# EAGLE design controller (EAGLE 5.12)
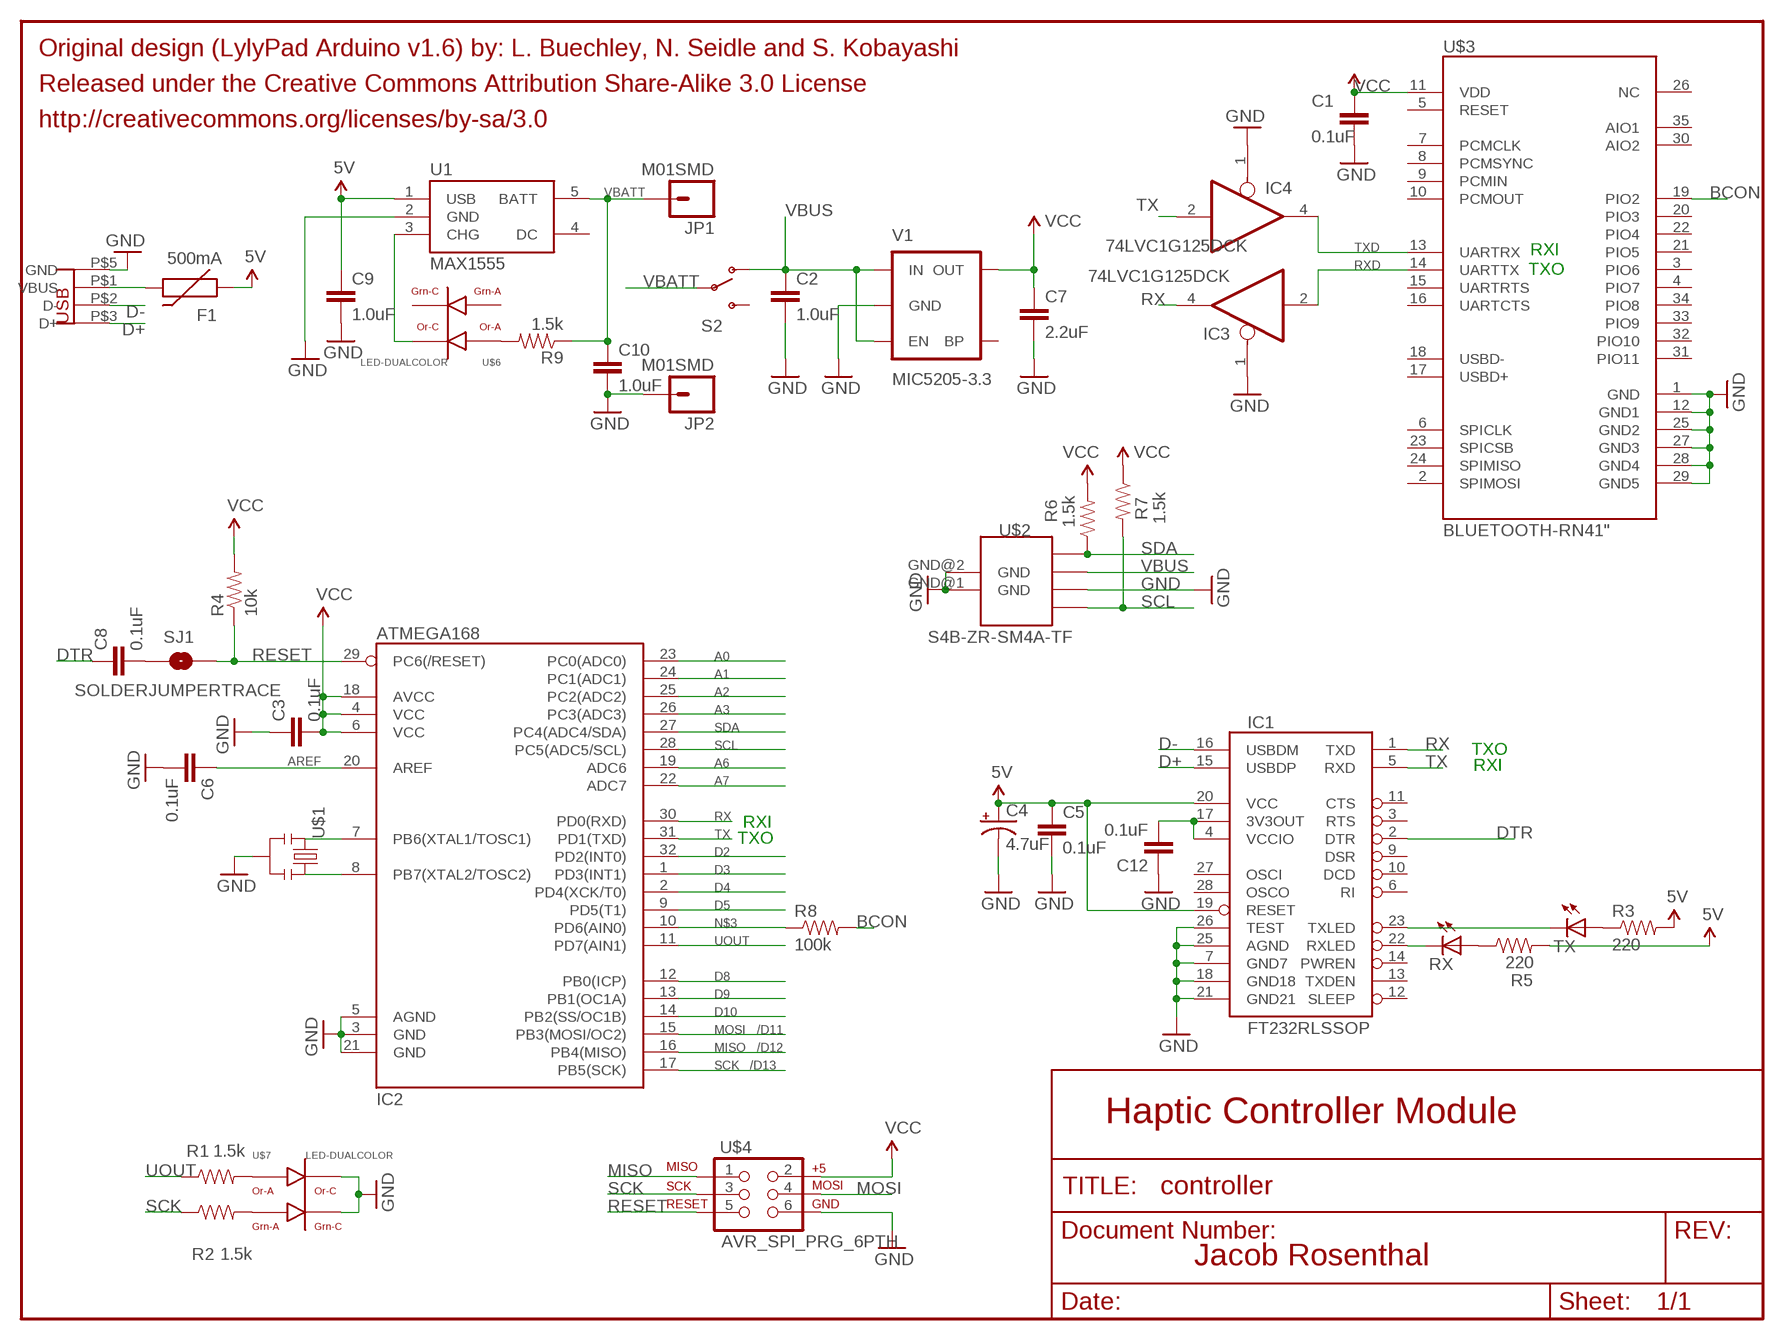
[diagram p0: schematic, sheet 1]

## Parts
C1  0.1uF  CAP0805  [0805]
C2  1.0uF  CAP0805  [0805]
C3  0.1uF  CAP0805  [0805]
C4  4.7uF  CAP_POL1206  [EIA3216]
C5  0.1uF  CAP0805  [0805]
C6  0.1uF  CAP0805  [0805]
C7  2.2uF  CAP0805  [0805]
C8  0.1uF  CAP0805  [0805]
C9  1.0uF  CAP0805  [0805]
C10  1.0uF  CAP0805  [0805]
C12  0.1uF  CAP0805  [0805]
F1  500mA  PTCSMD  [PTC-1206]
IC1  FT232RLSSOP  [SSOP28DB]
IC2  ATMEGA168  [TQFP32-08]
IC3  74LVC1G125DCK  [SC70-5]
IC4  74LVC1G125DCK  [SC70-5]
JP1  M01SMD  [LUXEON-PAD]
JP2  M01SMD  [LUXEON-PAD]
R1  1.5k  RESISTOR0805-RES  [0805]
R2  1.5k  RESISTOR0805-RES  [0805]
R3  220  RESISTOR0805-RES  [0805]
R4  10k  RESISTOR0805-RES  [0805]
R5  220  RESISTOR0805-RES  [0805]
R6  1.5k  RESISTOR0805-RES  [0805]
R7  1.5k  RESISTOR0805-RES  [0805]
R8  100k  RESISTOR0805-RES  [0805]
R9  1.5k  RESISTOR0805-RES  [0805]
RX  LEDCHIPLED_0805  [CHIPLED_0805]
S2  SWITCH-SPSTPTH  [SWITCH-SPDT]
SJ1  SOLDERJUMPERTRACE  [SJ_2S-TRACE]
TX  LEDCHIPLED_0805  [CHIPLED_0805]
U1  MAX1555  [SOT23-5]
U$1  CSTCE8M00G55Z  RESONATORSMD  [RESONATOR-SMD]
U$2  S4B-ZR-SM4A-TF  [S4B-ZR-SM4A-TF]
U$3  BLUETOOTH-RN41"  [RN41]
U$4  AVR_SPI_PRG_6PTH  [2X3]
U$6  LED-DUALCOLOR  [PLCC-4]
U$7  LED-DUALCOLOR  [PLCC-4]
V1  MIC5205-3.3  V_REG_LDOSMD  [SOT23-5]
X1  USBMICROB  [USB-MICROB]

## Nets
5V: C4.A(+) C5.1 C9.1 F1.1 IC1.19(RESET) IC1.20(VCC) R3.2 R5.2 U1.1(USB)
A0: IC2.23(PC0(ADC0))
A1: IC2.24(PC1(ADC1))
A2: IC2.25(PC2(ADC2))
A3: IC2.26(PC3(ADC3))
A6: IC2.19(ADC6)
A7: IC2.22(ADC7)
AREF: C6.1 IC2.20(AREF)
BCON: R8.2 U$3.19(PIO2)
D2: IC2.32(PD2(INT0))
D3: IC2.1(PD3(INT1))
D4: IC2.2(PD4(XCK/T0))
D5: IC2.9(PD5(T1))
D8: IC2.12(PB0(ICP))
D9: IC2.13(PB1(OC1A))
D10: IC2.14(PB2(SS/OC1B))
D+: IC1.15(USBDP) X1.P$3(D+)
D-: IC1.16(USBDM) X1.P$2(D-)
DTR: C8.1 IC1.2(DTR)
GND: C1.2 C2.2 C3.1 C4.C(-) C5.2 C6.2 C7.2 C9.2 C10.2 C12.1 IC1.7(GND7) IC1.18(GND18) IC1.21(GND21) IC1.25(AGND) IC1.26(TEST) IC2.3(GND) IC2.5(AGND) IC2.21(GND) IC3.1(OE) IC4.1(OE) JP2.P$1 U1.2(GND) U$1.2 U$2.GND@1(GND) U$2.GND@2(GND) U$2.P$2 U$3.1(GND) U$3.12(GND1) U$3.25(GND2) U$3.27(GND3) U$3.28(GND4) U$3.29(GND5) U$4.6 U$7.P$1 U$7.P$3 V1.2(GND) X1.P$5(GND)
MISO: IC2.16(PB4(MISO)) U$4.1
MOSI: IC2.15(PB3(MOSI/OC2)) U$4.4
N$1: IC1.23(TXLED) TX.C
N$2: U1.3(CHG) U$6.P$1
N$3: IC2.10(PD6(AIN0)) R8.1
N$4: F1.2 X1.P$1(VBUS)
N$5: C12.2 IC1.4(VCCIO) IC1.17(3V3OUT)
N$6: C8.2 SJ1.1
N$7: IC1.22(RXLED) RX.C
N$8: R9.2 U$6.P$2
N$9: R3.1 TX.A
N$10: IC2.7(PB6(XTAL1/TOSC1)) U$1.3
N$12: IC2.8(PB7(XTAL2/TOSC2)) U$1.1
N$13: R5.1 RX.A
N$14: R1.2 U$7.P$2
N$15: R2.2 U$7.P$4
RESET: IC2.29(PC6(/RESET)) R4.1 SJ1.2 U$4.5
RX: IC1.1(TXD) IC2.30(PD0(RXD)) IC3.4(O)
RXD: IC3.2(I) U$3.14(UARTTX)
SCK: IC2.17(PB5(SCK)) R2.1 U$4.3
SCL: IC2.28(PC5(ADC5/SCL)) R7.2 U$2.P$1
SDA: IC2.27(PC4(ADC4/SDA)) R6.1 U$2.P$4
TX: IC1.5(RXD) IC2.31(PD1(TXD)) IC4.2(I)
TXD: IC4.4(O) U$3.13(UARTRX)
UOUT: IC2.11(PD7(AIN1)) R1.1
VBATT [VCC]: C10.1 JP1.P$1 R9.1 S2.2(P) U1.5(BATT)
VBUS [VCC]: C2.1 S2.1(O) U$2.P$3 V1.1(IN) V1.3(EN)
VCC: C1.1 C3.2 C7.1 IC2.4(VCC) IC2.6(VCC) IC2.18(AVCC) R4.2 R6.2 R7.1 U$3.11(VDD) U$4.2 V1.5(OUT)
Unconnected: IC1.3(RTS) IC1.6(RI) IC1.9(DSR) IC1.10(DCD) IC1.11(CTS) IC1.12(SLEEP) IC1.13(TXDEN) IC1.14(PWREN) IC1.27(OSCI) IC1.28(OSCO) S2.3(S) U1.4(DC) U$3.2(SPIMOSI) U$3.3(PIO6) U$3.4(PIO7) U$3.5(RESET) U$3.6(SPICLK) U$3.7(PCMCLK) U$3.8(PCMSYNC) U$3.9(PCMIN) U$3.10(PCMOUT) U$3.15(UARTRTS) U$3.16(UARTCTS) U$3.17(USBD+) U$3.18(USBD-) U$3.20(PIO3) U$3.21(PIO5) U$3.22(PIO4) U$3.23(SPICSB) U$3.24(SPIMISO) U$3.26(NC) U$3.30(AIO2) U$3.31(PIO11) U$3.32(PIO10) U$3.33(PIO9) U$3.34(PIO8) U$3.35(AIO1) U$6.P$3 U$6.P$4 V1.4(BP)

## Notes on the sheet
- Original design (LylyPad Arduino v1.6) by: L. Buechley, N. Seidle and S. Kobayashi
- Released under the Creative Commons Attribution Share-Alike 3.0 License
- http://creativecommons.org/licenses/by-sa/3.0
- RXI
- TXO
- TXO
- RXI
- RXI
- TXO
- /D11
- /D12
- /D13
- Haptic Controller Module
- Jacob Rosenthal

## Power pins joined to a net without a drawn wire
GND: IC3.3(GND) IC4.3(GND)
VCC: IC3.5(VCC) IC4.5(VCC)

## Library data of the parts
C1-C3 C5-C10 C12 = SparkFun:CAP: Capacitor Standard 0603 ceramic capacitor, and 0.1" leaded capacitor.
C4 = haptic-controller:CAP_POL: Capacitor Polarized These are standard SMD and PTH capacitors. Normally 10uF, 47uF, and 100uF in electrolytic and tantalum varieties. Always verify the external diameter of the through hole cap, it varies with capacity, voltage, and manufacturer. The EIA devices should be standard. Originally From the Sparkfun Eagle Library @ www.opencircuits.com Dated Nov 3rd 2009 CC v3.0 Share-Alike
F1 = haptic-controller:PTC: Resettable Fuse PTC Resettable Fuse. Spark Fun Electronics SKU : COM-08357 Originally From the Sparkfun Eagle Library @ www.opencircuits.com Dated Nov 3rd 2009 CC v3.0 Share-Alike
IC1 = haptic-controller:FT232RL: USB UART FT232RL 4th Generation USB UART (USB <-> Serial) Controller. Spark Fun Electronics SKU : COM-00650 Originally From the Sparkfun Eagle Library @ www.opencircuits.com Dated Nov 3rd 2009 CC v3.0 Share-Alike
IC2 = haptic-controller:ATMEGA168: ATMEGA 168 Atmel AVR Originally From the Sparkfun Eagle Library @ www.opencircuits.com Dated Nov 3rd 2009 CC v3.0 Share-Alike
IC3 IC4 = 74xx-little-us:74*1G125: Single Bus Buffer Gate with 3-State Output
JP1 JP2 = haptic-controller:M01: Header 1 Standard 1-pin 0.1" header. Use with straight break away headers (SKU : PRT-00116), right angle break away headers (PRT-00553), swiss pins (PRT-00743), machine pins (PRT-00117), and female headers (PRT-00115). Originally From the Sparkfun Eagle Library @ www.opencircuits.com Dated Nov 3rd 2009 CC v3.0 Share-Alike
R1-R9 = SparkFun:RESISTOR: Resistor Basic schematic elements and footprints for 0603, 1206, and PTH resistors.
RX TX = led:LED: LED OSRAM: - CHIPLED LG R971, LG N971, LY N971, LG Q971, LY Q971, LO R971, LY R971 LH N974, LH R974 LS Q976, LO Q976, LY Q976 LO Q996 - Hyper CHIPLED LW Q18S LB Q993, LB Q99A, LB R99A - SideLED LS A670, LO A670, LY A670, LG A670, LP A670 LB A673, LV A673, LT A673, LW A673 LH A674 LY A675 LS A676, LA A676, LO A676, LY A676, LW A676 LS A679, LY A679, LG A679 - Hyper Micro SIDELED® LS Y876, LA Y876, LO Y876, LY Y876 LT Y87S - SmartLED LW L88C, LW L88S LB L89C, LB L89S, LG L890 LS L89K, LO L89K, LY L89K LS L896, LA L896, LO L896, LY L896 - TOPLED LS T670, LO T670, LY T670, LG T670, LP T670 LSG T670, LSP T670, LSY T670, LOP T670, LYG T670 LG T671, LOG T671, LSG T671 LB T673, LV T673, LT T673, LW T673 LH T674 LS T676, LA T676, LO T676, LY T676, LB T676, LH T676, LSB T676, LW T676 LB T67C, LV T67C, LT T67C, LS T67K, LO T67K, LY T67K, LW E67C LS E67B, LA E67B, LO E67B, LY E67B, LB E67C, LV E67C, LT E67C LW T67C LS T679, LY T679, LG T679 LS T770, LO T770, LY T770, LG T770, LP T770 LB T773, LV T773, LT T773, LW T773 LH T774 LS E675, LA E675, LY E675, LS T675 LS T776, LA T776, LO T776, LY T776, LB T776 LHGB T686 LT T68C, LB T68C - Hyper Mini TOPLED® LB M676 - Mini TOPLED Santana® LG M470 LS M47K, LO M47K, LY M47K Source: http://www.osram.convergy.de LUXEON: - LUMILED® LXK2-PW12-R00, LXK2-PW12-S00, LXK2-PW14-U00, LXK2-PW14-V00 LXK2-PM12-R00, LXK2-PM12-S00, LXK2-PM14-U00 LXK2-PE12-Q00, LXK2-PE12-R00, LXK2-PE12-S00, LXK2-PE14-T00, LXK2-PE14-U00 LXK2-PB12-K00, LXK2-PB12-L00, LXK2-PB12-M00, LXK2-PB14-N00, LXK2-PB14-P00, LXK2-PB14-Q00 LXK2-PR12-L00, LXK2-PR12-M00, LXK2-PR14-Q00, LXK2-PR14-R00 LXK2-PD12-Q00, LXK2-PD12-R00, LXK2-PD12-S00 LXK2-PH12-R00, LXK2-PH12-S00 LXK2-PL12-P00, LXK2-PL12-Q00, LXK2-PL12-R00 Source: www.luxeon.com KINGBRIGHT: KA-3528ASYC Source: www.kingbright.com
S2 = SparkFun:SWITCH-SPST: SPST Switch Simple slide switch. Spark Fun Electronics SKU : COM-00102
SJ1 = SparkFun:SOLDERJUMPER: Solder Jumper Standard SMD solder jumper. Used to automate production. Two varients : Normally Open and Normally Closed are the same, but have different paste layers. NC will have a large amount of paste and should jumper during reflow.
U1 = haptic-controller:MAX1555: MAX1555 Lithium Charger IC SOT-23 Lithium Polymer charging IC. Schematic element and footprint proven. Spark Fun Electronics SKU : COM-00674 Originally From the Sparkfun Eagle Library @ www.opencircuits.com Dated Nov 3rd 2009 CC v3.0 Share-Alike
U$1 = haptic-controller:RESONATOR: Resonator Small SMD resonator. This is the itty bitty 10/20MHz resonators with built in caps. CSTCE10M0G55 and CSTCE20M0V53. Footprint has been reviewed closely but hasn't been tested yet. Originally From the Sparkfun Eagle Library @ www.opencircuits.com Dated Nov 3rd 2009 CC v3.0 Share-Alike
U$2 = jjr:S4B-ZR-SM4A-TF: B4B-ZR-SM4-TF JST ZH 4pin side entry solder tab
U$3 = haptic-controller:BLUETOOTH-RN41: Roving Networks RN-41 Bluetooth Originally From the Sparkfun Eagle Library @ www.opencircuits.com Dated Nov 3rd 2009 CC v3.0 Share-Alike Altered to include restrict poly under chip antenna, ignore 3 restrict errors --jjrosent @ 1/11/2010
U$4 = haptic-controller:AVR_SPI_PRG_6: AVR ISP 6 Pin This is the reduced ISP connector for AVR programming. Common on Arduino. This footprint will take up less PCB space and can be used with a 10-pin to 6-pin adapter such as SKU: BOB-08508 Originally From the Sparkfun Eagle Library @ www.opencircuits.com Dated Nov 3rd 2009 CC v3.0 Share-Alike
U$6 U$7 = haptic-controller:LED-DUALCOLOR: Dual Color LED PLCC-4 Package. Based on OSRAM Opto Semiconductors Inc Part # LOG T77K-JL-1-0+GJ-1-0-2-R18-Z Designed for the CUbiC lab at Arizona State University by Jacob Rosenthal (jjrosent) 1/11/2010
V1 = haptic-controller:V_REG_LDO: Voltage Regulator LDO Standard 150mA LDO voltage regulator in SOT-23 layout. Micrel part MIC5205. BP (by-pass) pin is used to lower output noise with 470pF cap. Originally From the Sparkfun Eagle Library @ www.opencircuits.com Dated Nov 3rd 2009 CC v3.0 Share-Alike
X1 = haptic-controller:USBMICROB: Usb micro-b Designed for the CUbiC lab at Arizona State University by Jacob Rosenthal (jjrosent) 1/11/2010

## Net classes
0 Default: width 0.203 mm
1 VCC: width 0.701 mm
2 LEDPower: width 0.203 mm
3 ButtonSignal: width 0.203 mm
4 Bus: width 0.508 mm

## Board
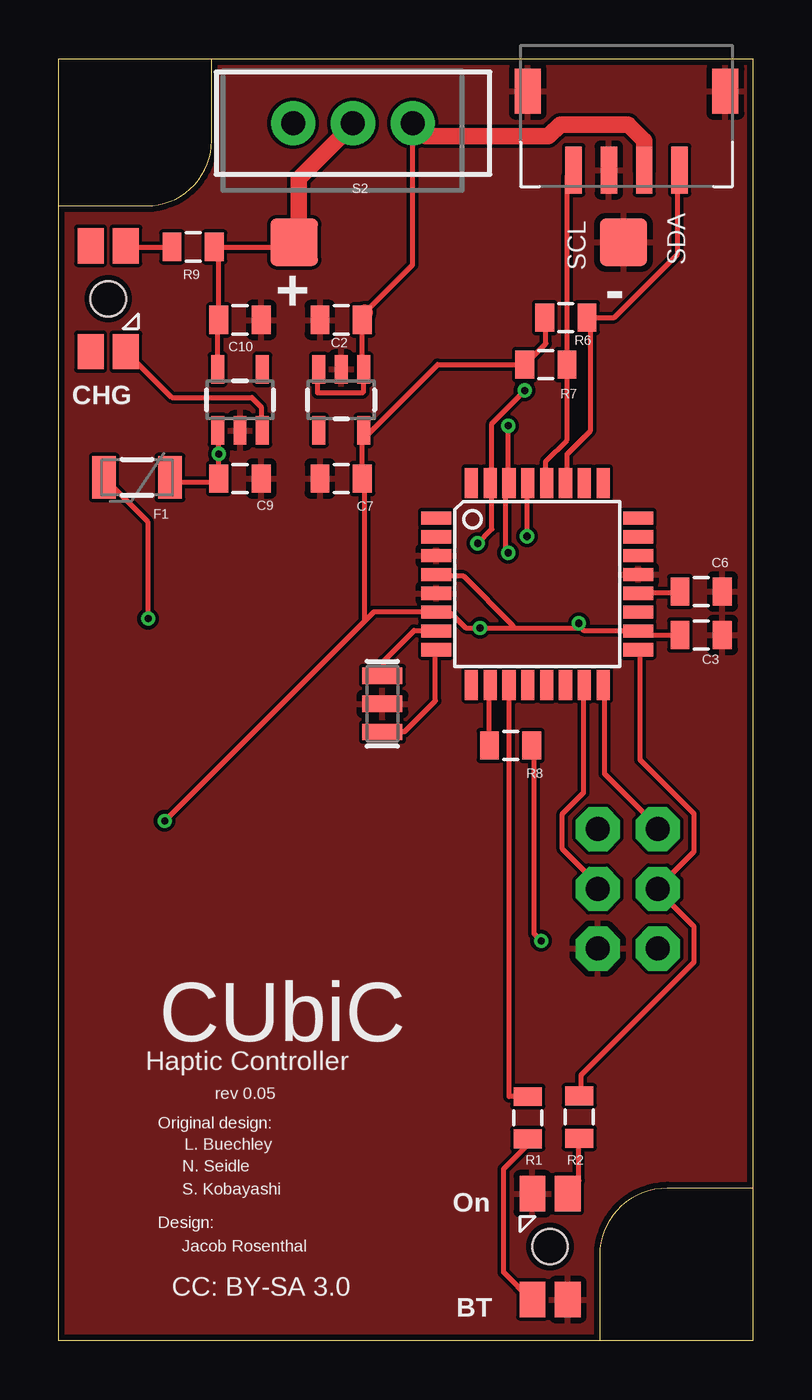
[diagram p1: board, top side]
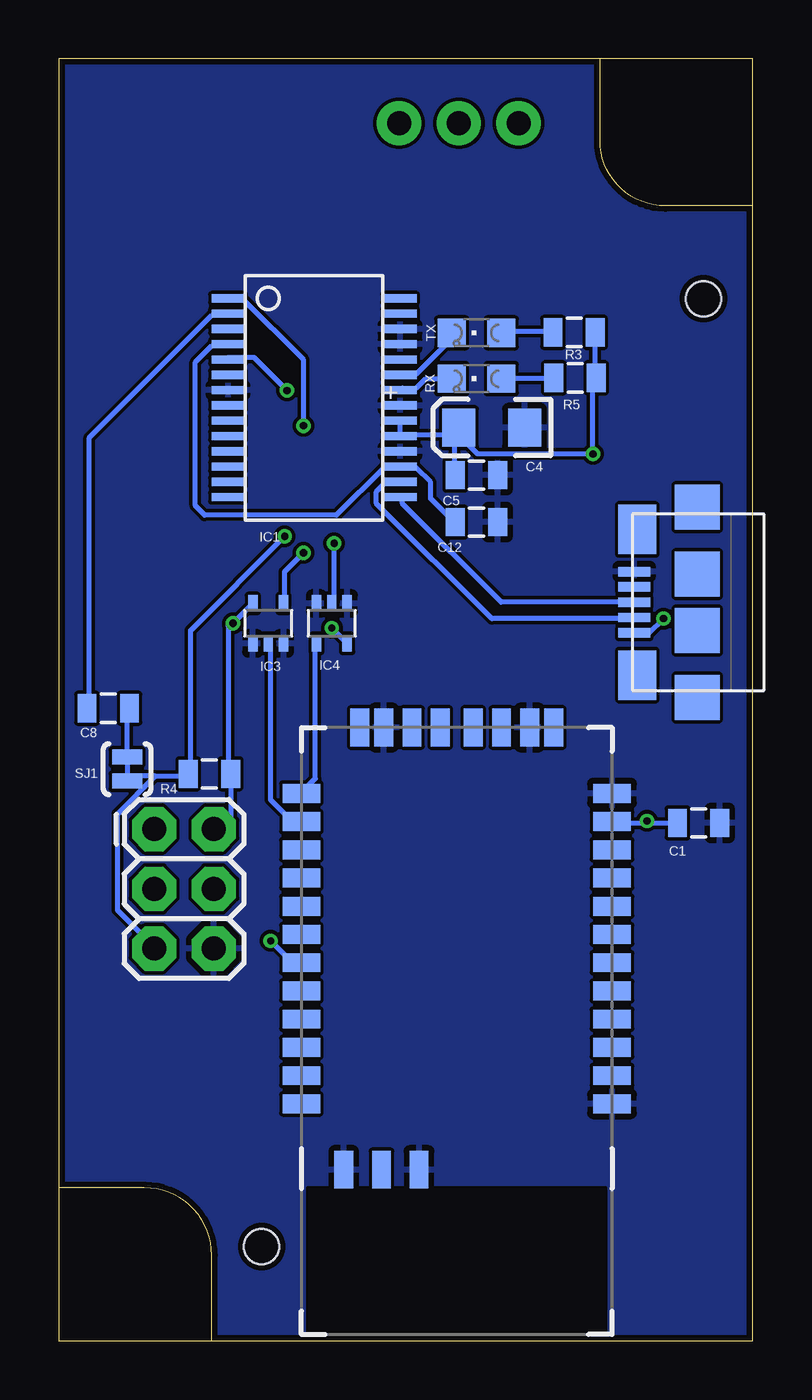
[diagram p2: board, bottom side, seen from below]

Size 29.5 x 54.5 mm. Coordinates in mm from the lower left corner, seen from the top.
Outline: 23,0 29.5,0 29.5,6.5
Outline: 23,0 0,0 0,48.25
Outline: 6.5,54.5 0,54.5 0,48.25
Outline: 6.5,54.5 29.5,54.5 29.5,6.5
Outline: 0,48.25 3.73,48.25 arc90 6.5,51.02 6.5,54.5
Outline: 23,0 23,3.64 arc-90 25.86,6.5 29.5,6.5
Copper layers (1*16): Top 0.035mm / dielectric 1.5mm / Bottom 0.035mm
Design rules "Fusion_eagle_rule_v1.1": minimum track width 6mil, minimum drill 12mil, track to track 6mil, track to pad 6mil, pad to pad 6mil, via to via 6mil, smd to smd 0mil, copper to edge 10mil, drill to drill 10mil, minimum pad ring 10mil, minimum via ring 6mil, stop-mask expansion 2mil, vias tented up to drill 100mil, thermal gap 10mil
bKeepout: area 25.1,7.3 to 27.6,9.8; area 2,11 to 4.5,13.5

### Footprints (pad centres in the part's own frame; a part is rotated, then mirrored left to right if it is on the bottom)
0805 = smd 0.8 x 1.2: 1 -0.9,0; 2 0.9,0
EIA3216 = smd 1.4 x 1.6: A 1.4,0; C -1.4,0
PTC-1206 = smd 1 x 1.8: 1 -1.4,0; 2 1.4,0
SSOP28DB = smd 0.348 x 1.397: 1 -4.225,-3.656; 2 -3.575,-3.656; 3 -2.925,-3.656; 4 -2.275,-3.656; 5 -1.625,-3.656; 6 -0.975,-3.656; 7 -0.325,-3.656; 8 0.325,-3.656; 9 0.975,-3.656; 10 1.625,-3.656; 11 2.275,-3.656; 12 2.925,-3.656; 13 3.575,-3.656; 14 4.225,-3.656; 15 4.225,3.656; 16 3.575,3.656; 17 2.925,3.656; 18 2.275,3.656; 19 1.625,3.656; 20 0.975,3.656; 21 0.325,3.656; 22 -0.325,3.656; 23 -0.975,3.656; 24 -1.625,3.656; 25 -2.275,3.656; 26 -2.925,3.656; 27 -3.575,3.656; 28 -4.225,3.656
TQFP32-08 = smd 1.27 x 0.559: 1 -4.293,2.8; 2 -4.293,2; 3 -4.293,1.2; 4 -4.293,0.4; 5 -4.293,-0.4; 6 -4.293,-1.2; 7 -4.293,-2; 8 -4.293,-2.8; 17 4.293,-2.8; 18 4.293,-2; 19 4.293,-1.2; 20 4.293,-0.4; 21 4.293,0.4; 22 4.293,1.2; 23 4.293,2; 24 4.293,2.8 | smd 0.559 x 1.27: 9 -2.8,-4.293; 10 -2,-4.293; 11 -1.2,-4.293; 12 -0.4,-4.293; 13 0.4,-4.293; 14 1.2,-4.293; 15 2,-4.293; 16 2.8,-4.293; 25 2.8,4.293; 26 2,4.293; 27 1.2,4.293; 28 0.4,4.293; 29 -0.4,4.293; 30 -1.2,4.293; 31 -2,4.293; 32 -2.8,4.293
SC70-5 = smd 0.4 x 0.7: 1 -0.65,-0.85; 2 0,-0.85; 3 0.65,-0.85; 4 0.65,0.85; 5 -0.65,0.85
LUXEON-PAD = smd 2 x 2: P$1 0,0
CHIPLED_0805 = smd 1.2 x 1.2: A 0,-1.05; C 0,1.05
SWITCH-SPDT = drill 1.016 pad 1.88 round: 1 0,2.54; 2 0,0; 3 0,-2.54
SJ_2S-TRACE = smd 0.635 x 1.27: 1 -0.508,0; 2 0.508,0
SOT23-5 = smd 0.55 x 1.2: 1 -0.95,-1.3; 2 0,-1.3; 3 0.95,-1.3; 4 0.95,1.3; 5 -0.95,1.3
RESONATOR-SMD = smd 0.7 x 1.7: 1 -1.2,0; 2 0,0; 3 1.2,0
S4B-ZR-SM4A-TF = smd 1.1 x 1.9: GND@1 -4.2,1.05; GND@2 4.2,1.05 | smd 0.7 x 2: P$1 -2.25,-2.3; P$2 -0.75,-2.3; P$3 0.75,-2.3; P$4 2.25,-2.3
RN41 = smd 0.8 x 1.6: 1 -6.6,-6.6; 2 -5.4,-6.6; 3 -4.2,-6.6; 4 -3,-6.6; 5 -1.8,-6.6; 6 -0.6,-6.6; 7 0.6,-6.6; 8 1.8,-6.6; 9 3,-6.6; 10 4.2,-6.6; 11 5.4,-6.6; 12 6.6,-6.6; 13 6.6,6.6; 14 5.4,6.6; 15 4.2,6.6; 16 3,6.6; 17 1.8,6.6; 18 0.6,6.6; 19 -0.6,6.6; 20 -1.8,6.6; 21 -3,6.6; 22 -4.2,6.6; 23 -5.4,6.6; 24 -6.6,6.6 | smd 1.6 x 0.8: 25 -9.4,4.8; 26 -9.4,3.2; 27 -9.4,1.6; 28 9.4,3.1; 29 9.4,-3.1; 30 9.4,-4.122; 31 9.4,-1.9; 32 9.4,-0.7; 33 9.4,0.7; 34 9.4,1.9; 35 9.4,4.122
2X3 = drill 1.016 pad 1.88 octagon: 1 0,0; 2 0,2.54; 3 2.54,0; 4 2.54,2.54; 5 5.08,0; 6 5.08,2.54
PLCC-4 = smd 1.5 x 1.1: P$1 -2.25,-0.75; P$2 2.25,-0.75; P$3 2.25,0.75; P$4 -2.25,0.75 | hole 1.5: 0,0
USB-MICROB = smd 0.4 x 1.35: P$1 -1.3,2.675; P$2 -0.65,2.675; P$3 0,2.675; P$4 0.65,2.675; P$5 1.3,2.675 | smd 2.1 x 1.6: P$6 -3.1,2.55; P$7 3.1,2.55 | smd 1.9 x 1.9: P$8 -4.05,0; P$9 -1.2,0; P$10 1.2,0; P$11 4.05,0

### Placement (x,y rotation side)
C1  2.31,22.01 0 bottom
C2  12,43.4 180 top
C3  27.3,30 180 top
C4  11.1,38.82 180 bottom
C5  11.75,36.8 0 bottom
C6  27.3,31.85 0 top
C7  12,36.65 180 top
C8  27.4,26.89 0 bottom
C9  7.7,36.65 0 top
C10  7.7,43.4 0 top
C12  11.75,34.8 180 bottom
F1  3.33,36.7 180 top
IC1  18.65,40.09 270 bottom
IC2  20.33,32.18 0 top
IC3  20.6,30.5 0 bottom
IC4  17.9,30.5 180 bottom
JP1  10,46.7 90 top
JP2  24,46.7 270 top
R1  19.93,9.48 270 top
R2  22.12,9.51 270 top
R3  7.6,42.87 0 bottom
R4  23.1,24.1 0 bottom
R5  7.56,40.94 0 bottom
R6  21.55,43.5 180 top
R7  20.7,41.5 0 top
R8  19.2,25.31 0 top
R9  5.71,46.5 180 top
RX  11.75,40.9 90 bottom
S2  12.5,51.76 270 top
SJ1  26.6,24.3 270 bottom
TX  11.75,42.85 90 bottom
U1  7.7,40 0 top
U$1  13.75,27.08 90 top
U$2  24.13,52.07 0 top
U$3  12.59,16.67 90 bottom
U$4  25.45,21.75 270 bottom
U$6  2.1,44.3 90 top
U$7  20.88,4 270 top
V1  12,40 180 top
X1  2.37,31.39 90 bottom

### Tracks (layer width: path | path; a pad name or v marks a point on that pad's centre or on a via)
5V  (via drill 0.3)
  Top 0.203: 6.7,36.5 6.8,36.6 C9.1 | C9.1 6.6,36.5 5,36.5 4.8,36.7 F1.1 | 6.7,38.7 U1.1 6.8,38.6 v6.8,37.7 C9.1
  Bottom 0.203: IC1.20 15,39.1 15,38.5 IC1.19 14.9,38.5 12.4,38.5 C4.A | 12.3,38.5 12.6,38.8 C4.A | R5.2 6.7,41 | R5.2 6.6,40.9 | C4.A 12.2,38.2 11.7,37.7 v6.8,37.7 6.8,41 R5.2 | R5.2 6.7,41.1 R3.2 | R5.2 6.6,40.8 | C4.A 12.2,38.3 | C5.1 12.7,36.8 12.7,38.4 C4.A
AREF
  Top 0.203: C6.1 26.4,31.8 24.7,31.8 IC2.20
BCON  (via drill 0.3)
  Top 0.203: v20.5,17 20.2,17.3 20.2,25.3 R8.2
  Bottom 0.203: 18.8,16.1 19.1,16.1 U$3.19 19.2,16.1 19.6,16.1 v20.5,17
D+
  Bottom 0.203: X1.P$3 5.1,31.4 10.7,31.4 14.9,35.6 14.9,35.8 IC1.15
D-
  Bottom 0.203: X1.P$2 5.1,30.7 11.1,30.7 16,35.6 16,36.1 15.6,36.5 15,36.5 IC1.16
DTR
  Bottom 0.203: C8.1 28.2,26.9 28.2,38.4 23,43.6 22.4,43.6 IC1.2
GND
  pour Top: 0,54.5 0,0 29.5,0 29.5,54.5
  pour Bottom: 0,54.5 29.5,54.5 29.5,0 0,0
MISO
  Top 0.203: IC2.16 23.2,27.8 23.2,24.1 25.5,21.8 U$4.1
MOSI
  Top 0.203: IC2.15 22.3,27.8 22.3,23.3 21.4,22.4 21.4,20.9 23,19.3 U$4.4
N$1
  Bottom 0.203: TX.C 12.9,42.8 12.9,42.5 14.3,41.1 14.9,41.1 IC1.23
N$2
  Top 0.203: U1.3 8.6,38.7 8.6,39.7 8.2,40.1 4.8,40.1 U$6.P$1
N$3
  Top 0.203: R8.1 18.3,27.8 IC2.10
N$4  (via drill 0.3)
  Top 0.203: v3.8,30.7 3.8,34.8 1.9,36.7 F1.2
  Bottom 0.203: v3.8,30.7 4.4,30.1 5,30.1 X1.P$1
N$5
  Bottom 0.203: IC1.4 22.4,42.3 23,42.3 23.7,41.6 23.7,35.5 23.3,35.1 17.7,35.1 15.7,37.1 15,37.1 IC1.17 14.9,37.1 14.3,37.1 13.7,36.5 13.7,35.8 12.7,34.8 C12.2
N$6
  Bottom 0.203: C8.2 26.6,26.89 SJ1.1
N$7
  Bottom 0.203: RX.C 13.9,40.9 14.3,40.5 14.9,40.5 IC1.22
N$8
  Top 0.203: R9.2 2.9,46.5 U$6.P$2
N$9
  Bottom 0.203: R3.1 8.5,42.9 10.7,42.9 TX.A
N$10
  Top 0.203: IC2.7 16,30.2 15.1,30.2 13.8,28.9 13.8,28.3 U$1.3
N$12
  Top 0.203: IC2.8 16,29.3 16,27.2 14.7,25.9 13.8,25.9 U$1.1
N$13
  Bottom 0.203: R5.1 8.5,40.9 RX.A
N$14
  Top 0.203: R1.2 19.9,8.5 19.9,8.3 18.9,7.3 18.9,2.9 20.1,1.7 U$7.P$2
N$15
  Top 0.203: R2.2 22.1,8.6 22.1,6.8 21.6,6.3 U$7.P$4
RESET  (via drill 0.3)
  Top 0.203: v19.9,34.2 19.9,36.4 IC2.29
  Bottom 0.203: v19.9,34.2 23.9,30.2 23.9,24.3 R4.1 | R4.1 23.9,24.2 | 25.4,24 24.1,24 R4.1 | 25.4,24 27,22.4 27,18.3 25.4,16.7 U$4.5 | 25.4,24 26.6,24 SJ1.2
RX  (via drill 0.3)
  Top 0.203: v19.1,38.9 19.1,36.5 IC2.30 | 19.3,36.3 19.2,36.4 IC2.30 | IC2.30 19,36.5 | 19,33.6 v19.1,33.5 19,33.7 19,36.4 IC2.30
  Bottom 0.203: v19.1,38.9 19.1,41.7 21.7,44.3 22.3,44.3 IC1.1 | IC3.4 19.9,31.4 19.9,32.7 v19.1,33.5
RXD
  Bottom 0.203: IC3.2 20.5,29.6 20.5,23 19.6,22.1 19.2,22.1 U$3.14
SCK
  Top 0.203: R2.1 22.2,10.5 22.2,11.3 27,16.1 27,17.6 25.4,19.2 U$4.3 25.5,19.3 27,20.8 27,22.4 24.7,24.7 24.7,29.3 IC2.17
SCL
  Top 0.203: IC2.28 20.7,36.5 20.7,37.4 21.6,38.3 R7.2 21.6,49.49 U$2.P$1
SDA
  Top 0.203: U$2.P$4 26.3,49.7 26.3,46.2 23.6,43.5 R6.1 22.6,43.4 22.6,38.7 21.6,37.7 21.6,36.5 IC2.27
TX  (via drill 0.3)
  Top 0.203: v19.8,40.4 18.4,39 18.4,36.5 IC2.31 | IC2.31 18.3,36.4 | v17.8,33.9 18.4,34.5 18.4,36.4 IC2.31
  Bottom 0.203: v19.8,40.4 21.2,41.8 22.3,41.8 IC1.5 | 17.8,31.4 IC4.2 17.8,31.5 v17.8,33.9
TXD
  Bottom 0.203: IC4.4 18.6,29.6 18.6,23.9 19.2,23.3 U$3.13
UOUT
  Top 0.203: R1.1 19.13,10.38 IC2.11
VBATT
  Top 0.203: 9.8,46.5 R9.1 6.8,46.31 C10.1 6.75,43.35 U1.5
  Top 0.701: 9.8,46.5 JP1.P$1 10.2,46.9 10.2,49.4 12.5,51.7 S2.2
VBUS
  Top 0.203: V1.3 11,41.25 11,40.3 12.9,40.3 12.95,40.35 V1.1 12.9,41.35 C2.1 | 13,43.7 15.04,45.74 S2.1
  Top 0.701: C2.1 13,43.7 | S2.1 15.6,51.2 20.8,51.2 21.3,51.7 24.2,51.7 24.88,51.02 U$2.P$3
VCC  (via drill 0.3)
  Top 0.203: R6.2 20.7,43.5 20.7,42.4 R7.1 16.1,41.5 13,38.4 V1.5 12.9,38.6 C7.1 13,36.6 13,30.7 13.05,30.65 | C3.2 24.8,30 24.7,30.1 IC2.18 24.6,30.2 22.3,30.2 22.2,30.3 22.1,30.3 | 19.3,30.3 22.1,30.3 | 19.3,30.3 v17.9,30.3 17.3,30.3 16.7,30.9 16.1,30.9 IC2.6 16,31 13.4,31 13.05,30.65 | 22.1,30.3 v22.1,30.5 | IC2.4 16.1,32.5 17.2,32.5 19.3,30.4 19.3,30.3 | v4.5,22.1 13.05,30.65
  Bottom 0.203: 22.2,21.8 U$4.2 22.2,21.9 R4.2 22.3,24.2 22.3,30.4 v22.1,30.5 | v17.9,30.3 IC4.5 | v22.1,30.5 IC3.5 | v22.1,30.5 22.2,30.4 | U$3.11 5.9,22 4.6,22 v4.5,22.1 4.4,22 3.3,22 C1.1

### Text on the board
tPlace: SCL | SDA | + | - | CHG | CUbiC | Haptic Controller | rev 0.05 | Original design: | L. Buechley | N. Seidle | S. Kobayashi | On | Design: | Jacob Rosenthal | CC: BY-SA 3.0 | BT
bPlace: +
_tNames: S2 | R9 | C2 | C8 | R4 | C7 | C3 | C6 | R8 | C1 | R1 | R2
_bNames: R6 | R7 | R3 | C10 | R5 | TXLED | RXLED | C9 | C5 | C4 | IC1 | F1